# EAGLE design radio103 (EAGLE 9.6.2)

## Sheet 1 of 3: mixer
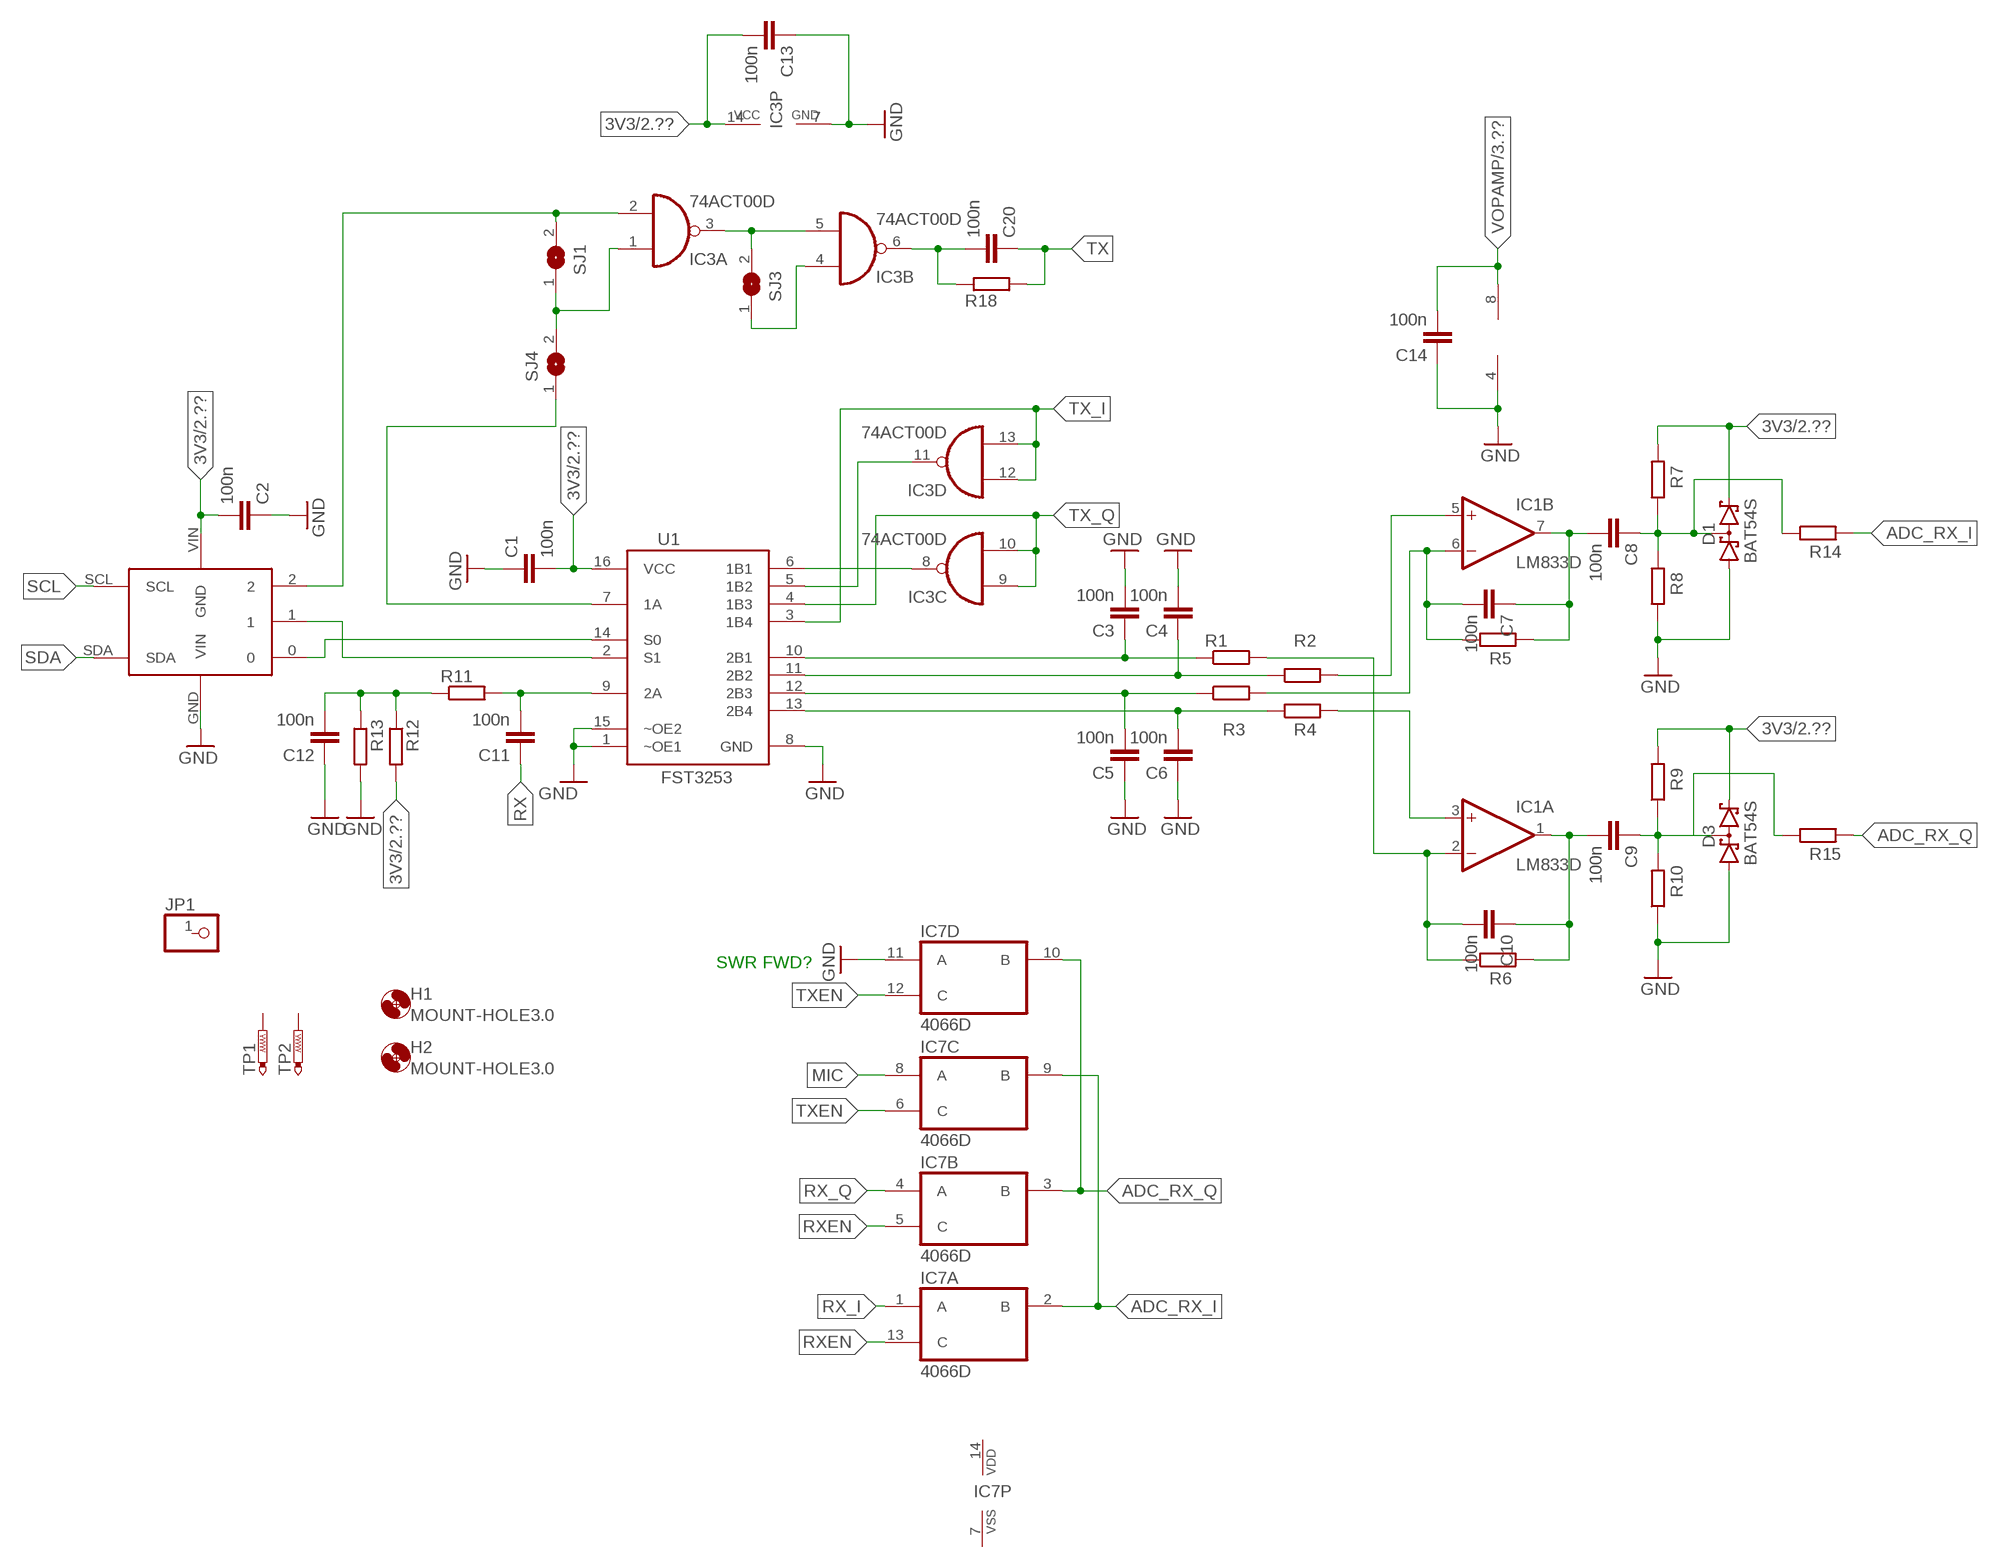
[diagram p0: schematic, sheet 1]

### Parts
C1  100n  C-EUC0805K  [C0805K]
C2  100n  C-EUC0805K  [C0805K]
C3  100n  C-EUC0805K  [C0805K]
C4  100n  C-EUC0805K  [C0805K]
C5  100n  C-EUC0805K  [C0805K]
C6  100n  C-EUC0805K  [C0805K]
C7  100n  C-EUC0805K  [C0805K]
C8  100n  C-EUC0805K  [C0805K]
C9  100n  C-EUC0805K  [C0805K]
C10  100n  C-EUC0805K  [C0805K]
C11  100n  C-EUC0805K  [C0805K]
C12  100n  C-EUC0805K  [C0805K]
C13  100n  C-EUC0805K  [C0805K]
C14  100n  C-EUC0805K  [C0805K]
C20  100n  C-EUC0805K  [C0805K]
D1  BAT54S  [SOT23]
D3  BAT54S  [SOT23]
H1  MOUNT-HOLE3.0  [3,0]
H2  MOUNT-HOLE3.0  [3,0]
IC1  LM833D  [SO08]
IC3  74ACT00D  [SO14]
IC7  4066D  [SO14]
JP1  PINHD-1X1  [1X01]
R1  R-EU_R0805  [R0805]
R2  R-EU_R0805  [R0805]
R3  R-EU_R0805  [R0805]
R4  R-EU_R0805  [R0805]
R5  R-EU_R0805  [R0805]
R6  R-EU_R0805  [R0805]
R7  R-EU_R0805  [R0805]
R8  R-EU_R0805  [R0805]
R9  R-EU_R0805  [R0805]
R10  R-EU_R0805  [R0805]
R11  R-EU_R0805  [R0805]
R12  R-EU_R0805  [R0805]
R13  R-EU_R0805  [R0805]
R14  R-EU_R0805  [R0805]
R15  R-EU_R0805  [R0805]
R18  R-EU_R0805  [R0805]
SJ1  SJ  [SJ]
SJ3  SJ  [SJ]
SJ4  SJ  [SJ]
TP1  PTR1B2,54  [B2,54]
TP2  PTR1B1,27  [B1,27]
U1  FST3253  [TSSOP16L]
U$2  CJMCU-5351  [CJMCU-5351]

### Nets
3V3: C1.2 C2.2 C13.2 D1.2(C2) D3.2(C2) IC3.14(P:VCC) R7.2 R9.2 R12.2 U1.16(VCC) U$2.VIN(GND) ; also sheet 2
ADC_I1: C8.1 D1.3(C1A2) R7.1 R8.2 R14.1
ADC_Q1: C9.1 D3.3(C1A2) R9.1 R10.2 R15.1
ADC_RX_I: IC7.2(A:B) IC7.9(C:B) R14.2
ADC_RX_Q: IC7.3(B:B) IC7.10(D:B) R15.2
GND: C1.1 C2.1 C3.2 C4.2 C5.1 C6.1 C12.1 C13.1 C14.1 D1.1(A1) D3.1(A1) IC1.4(P:V-) IC3.7(P:GND) IC7.11(D:A) R8.1 R10.1 R13.2 U1.1(~OE1) U1.8(GND) U1.15(~OE2) U$2.GND(VIN) ; also sheet 2,3
MIC: IC7.8(C:A)
N$1: C3.1 R1.1 U1.10(2B1)
N$2: C4.1 R2.1 U1.11(2B2)
N$3: C5.2 R3.1 U1.12(2B3)
N$4: C6.2 R4.1 U1.13(2B4)
N$5: C10.2 IC1.2(A:-IN) R1.2 R6.1
N$6: IC1.5(B:+IN) R2.2
N$7: C7.2 IC1.6(B:-IN) R3.2 R5.1
N$8: IC1.3(A:+IN) R4.2
N$9: C9.2 C10.1 IC1.1(A:OUT) R6.2
N$10: C7.1 C8.2 IC1.7(B:OUT) R5.2
N$12: C11.2 R11.2 U1.9(2A)
N$13: U1.2(S1) U$2.1
N$14: C12.2 R11.1 R12.1 R13.1
N$15: U1.14(S0) U$2.0
N$17: IC3.8(C:O) U1.6(1B1)
N$18: IC3.11(D:O) U1.5(1B2)
N$26: IC3.2(A:I1) SJ1.2 U$2.2
N$27: IC3.1(A:I0) SJ1.1 SJ4.2
N$28: IC3.3(A:O) IC3.5(B:I1) SJ3.2
N$29: IC3.4(B:I0) SJ3.1
N$30: C20.2 IC3.6(B:O) R18.1
N$31: SJ4.1 U1.7(1A)
RX: C11.1
RX_I: IC7.1(A:A)
RX_Q: IC7.4(B:A)
RXEN: IC7.5(B:C) IC7.13(A:C)
SCL: U$2.SCL
SDA: U$2.SDA
TX: C20.1 R18.2
TX_I: IC3.12(D:I0) IC3.13(D:I1) U1.3(1B4)
TX_Q: IC3.9(C:I0) IC3.10(C:I1) U1.4(1B3)
TXEN: IC7.6(C:C) IC7.12(D:C)
VOPAMP: C14.2 IC1.8(P:V+) ; also sheet 3
Unconnected: JP1.1 TP1.TP TP2.TP

### Notes on the sheet
- SWR FWD?

## Sheet 2 of 3: power
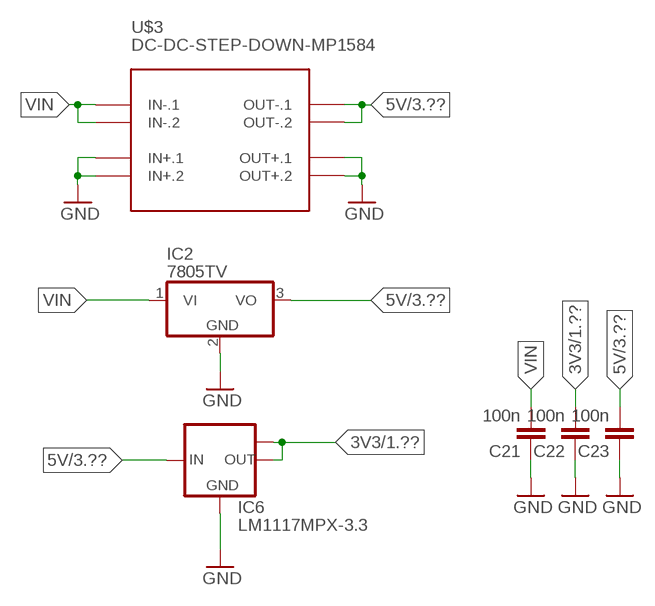
[diagram p1: schematic, sheet 2]

### Parts
C21  100n  C-EUC0805K  [C0805K]
C22  100n  C-EUC0805K  [C0805K]
C23  100n  C-EUC0805K  [C0805K]
IC2  7805TV  [TO220V]
IC6  LM1117MPX-3.3  [SOT223]
U$3  DC-DC-STEP-DOWN-MP1584  [DC-DC-STEP-DOWN-MP1584]

### Nets
3V3: C22.2 IC6.2(OUT) IC6.TAB(OUT1) ; also sheet 1
5V: C23.2 IC2.3(VO) IC6.3(IN) U$3.OUT-.1 U$3.OUT-.2 ; also sheet 3
GND: C21.1 C22.1 C23.1 IC2.2(GND) IC6.1(GND) U$3.IN+.1 U$3.IN+.2 U$3.OUT+.1 U$3.OUT+.2 ; also sheet 1,3
VIN: C21.2 IC2.1(VI) U$3.IN-.1 U$3.IN-.2

## Sheet 3 of 3: audio
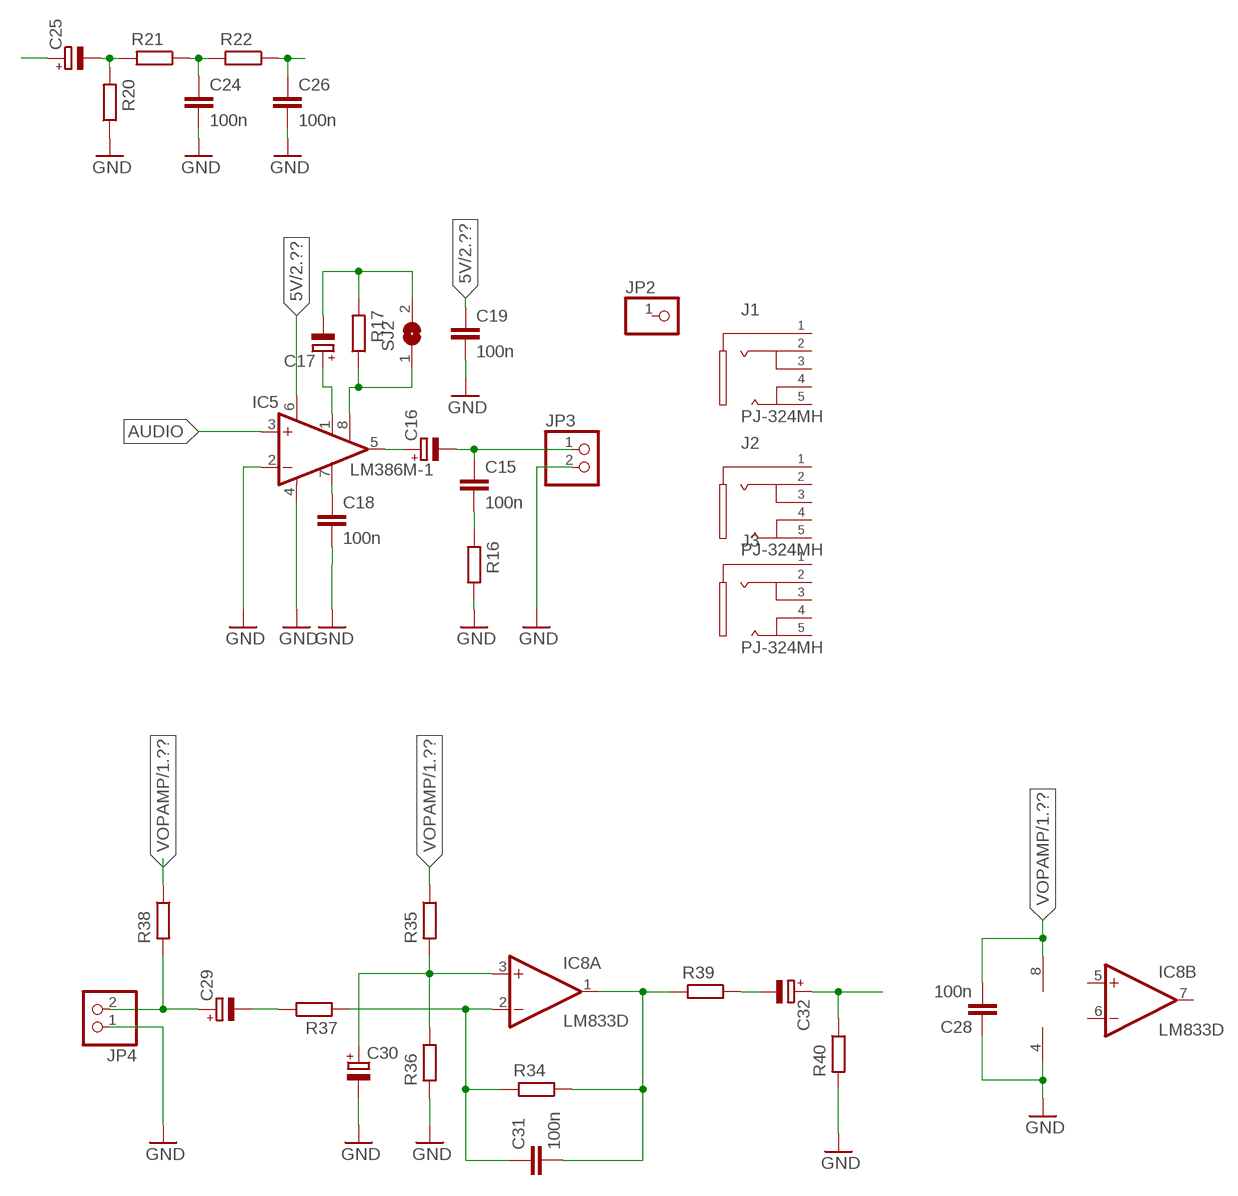
[diagram p2: schematic, sheet 3]

### Parts
C15  100n  C-EUC0805K  [C0805K]
C16  CPOL-EUE2,5-6E  [E2,5-6E]
C17  CPOL-EUE2,5-6E  [E2,5-6E]
C18  100n  C-EUC0805K  [C0805K]
C19  100n  C-EUC0805K  [C0805K]
C24  100n  C-EUC0805K  [C0805K]
C25  CPOL-EUE2,5-6E  [E2,5-6E]
C26  100n  C-EUC0805K  [C0805K]
C28  100n  C-EUC0805K  [C0805K]
C29  CPOL-EUE2,5-6E  [E2,5-6E]
C30  CPOL-EUE2,5-6E  [E2,5-6E]
C31  100n  C-EUC0805K  [C0805K]
C32  CPOL-EUE2,5-6E  [E2,5-6E]
IC5  LM386M-1  [SO08]
IC8  LM833D  [SO08]
J1  PJ-324MH  [PJ-324MH]
J2  PJ-324MH  [PJ-324MH]
J3  PJ-324MH  [PJ-324MH]
JP2  PINHD-1X1  [1X01]
JP3  PINHD-1X2  [1X02]
JP4  PINHD-1X2  [1X02]
R16  R-EU_R0805  [R0805]
R17  R-EU_R0805  [R0805]
R20  R-EU_R0805  [R0805]
R21  R-EU_R0805  [R0805]
R22  R-EU_R0805  [R0805]
R34  R-EU_R0805  [R0805]
R35  R-EU_R0805  [R0805]
R36  R-EU_R0805  [R0805]
R37  R-EU_R0805  [R0805]
R38  R-EU_R0805  [R0805]
R39  R-EU_R0805  [R0805]
R40  R-EU_R0805  [R0805]
SJ2  SJ  [SJ]

### Nets
5V: C19.1 IC5.6(VS) ; also sheet 2
AUDIO: IC5.3(+IN)
GND: C18.2 C19.2 C24.2 C26.2 C28.1 C30.- IC5.2(-IN) IC5.4(GND) IC8.4(P:V-) JP3.2 JP4.1 R16.1 R20.1 R36.2 R40.2 ; also sheet 1,2
N$19: C17.+ IC5.1(GAIN)
N$20: IC5.8(GAIN) R17.1 SJ2.1
N$21: C17.- R17.2 SJ2.2
N$22: C18.1 IC5.7(BYPASS)
N$23: C16.+ IC5.5(OUT)
N$24: C15.1 C16.- JP3.1
N$25: C15.2 R16.2
N$32: C25.- R20.2 R21.2
N$33: C24.1 R21.1 R22.2
N$34: C26.1 R22.1
N$35: C25.+
N$48: C30.+ IC8.3(A:+IN) R35.2 R36.1
N$49: C31.1 IC8.2(A:-IN) R34.2 R37.2
N$50: C31.2 IC8.1(A:OUT) R34.1 R39.2
N$51: C29.- R37.1
N$52: C29.+ JP4.2 R38.2
N$53: C32.- R39.1
N$54: C32.+ R40.1
VOPAMP: C28.2 IC8.8(P:V+) R35.1 R38.1 ; also sheet 1
Unconnected: IC8.5(B:+IN) IC8.6(B:-IN) IC8.7(B:OUT) J1.1 J1.2 J1.3 J1.4 J1.5 J2.1 J2.2 J2.3 J2.4 J2.5 J3.1 J3.2 J3.3 J3.4 J3.5 JP2.1

## Power pins joined to a net without a drawn wire
VDD: IC7.14(P:VDD)
VSS: IC7.7(P:VSS)

## Library data of the parts
C1-C15 C18-C24 C26 C28 C31 = rcl:C-EU: CAPACITOR, European symbol; SPICEPREFIX: C
C16 C17 C25 C29 C30 C32 = rcl:CPOL-EU: POLARIZED CAPACITOR, European symbol; SPICEPREFIX: C
D1 D3 = diode:BAT54S: Schottky Diodes Pin connection corrected 2011-05-04 Source: Fairchild .. BAT54.pdf
H1 H2 = holes:MOUNT-HOLE: MOUNTING HOLE with drill center marker
IC1 IC8 = linear:LM833: OP AMP
IC2 = linear:78*: Positive VOLTAGE REGULATOR Source: http://cache.national.com/ds/LM/LM78L05.pdf http://www.fairchildsemi.com/ds/LM/LM7805.pdf
IC3 = 74xx-eu:74*00: Quad 2-input NAND gate
IC5 = linear:LM386?-*: Low Voltage Audio Power Amplifier Source: http://cache.national.com/ds/LM/LM386.pdf
IC6 = lm1117:LM1117MPX-*
IC7 = 40xx:4066: Quad bilateral ANALOG SWITCH
J1-J3 = ub0baa:PJ-324M
JP1 JP2 = pinhead:PINHD-1X1: PIN HEADER
JP3 JP4 = pinhead:PINHD-1X2: PIN HEADER
R1-R18 R20-R22 R34-R40 = rcl:R-EU_: RESISTOR, European symbol; SPICEPREFIX: R
SJ1-SJ4 = jumper:SJ: SMD solder JUMPER
TP1 TP2 = testpad:PTR1: TEST PIN
U1 = ub0baa:FST3253
U$2 = ub0baa:CJMCU-5351
U$3 = diy-modules:DC-DC-STEP-DOWN-MP1584: DC/DC Step-Down Regulator based on MP1584 chip MP1584 datasheet available here: http://www.haoyuelectronics.com/Attachment/MP1584/MP1584.pdf Click here to find device on ebay.com <http://www.ebay.com/sch/mp1584+module>

## Board
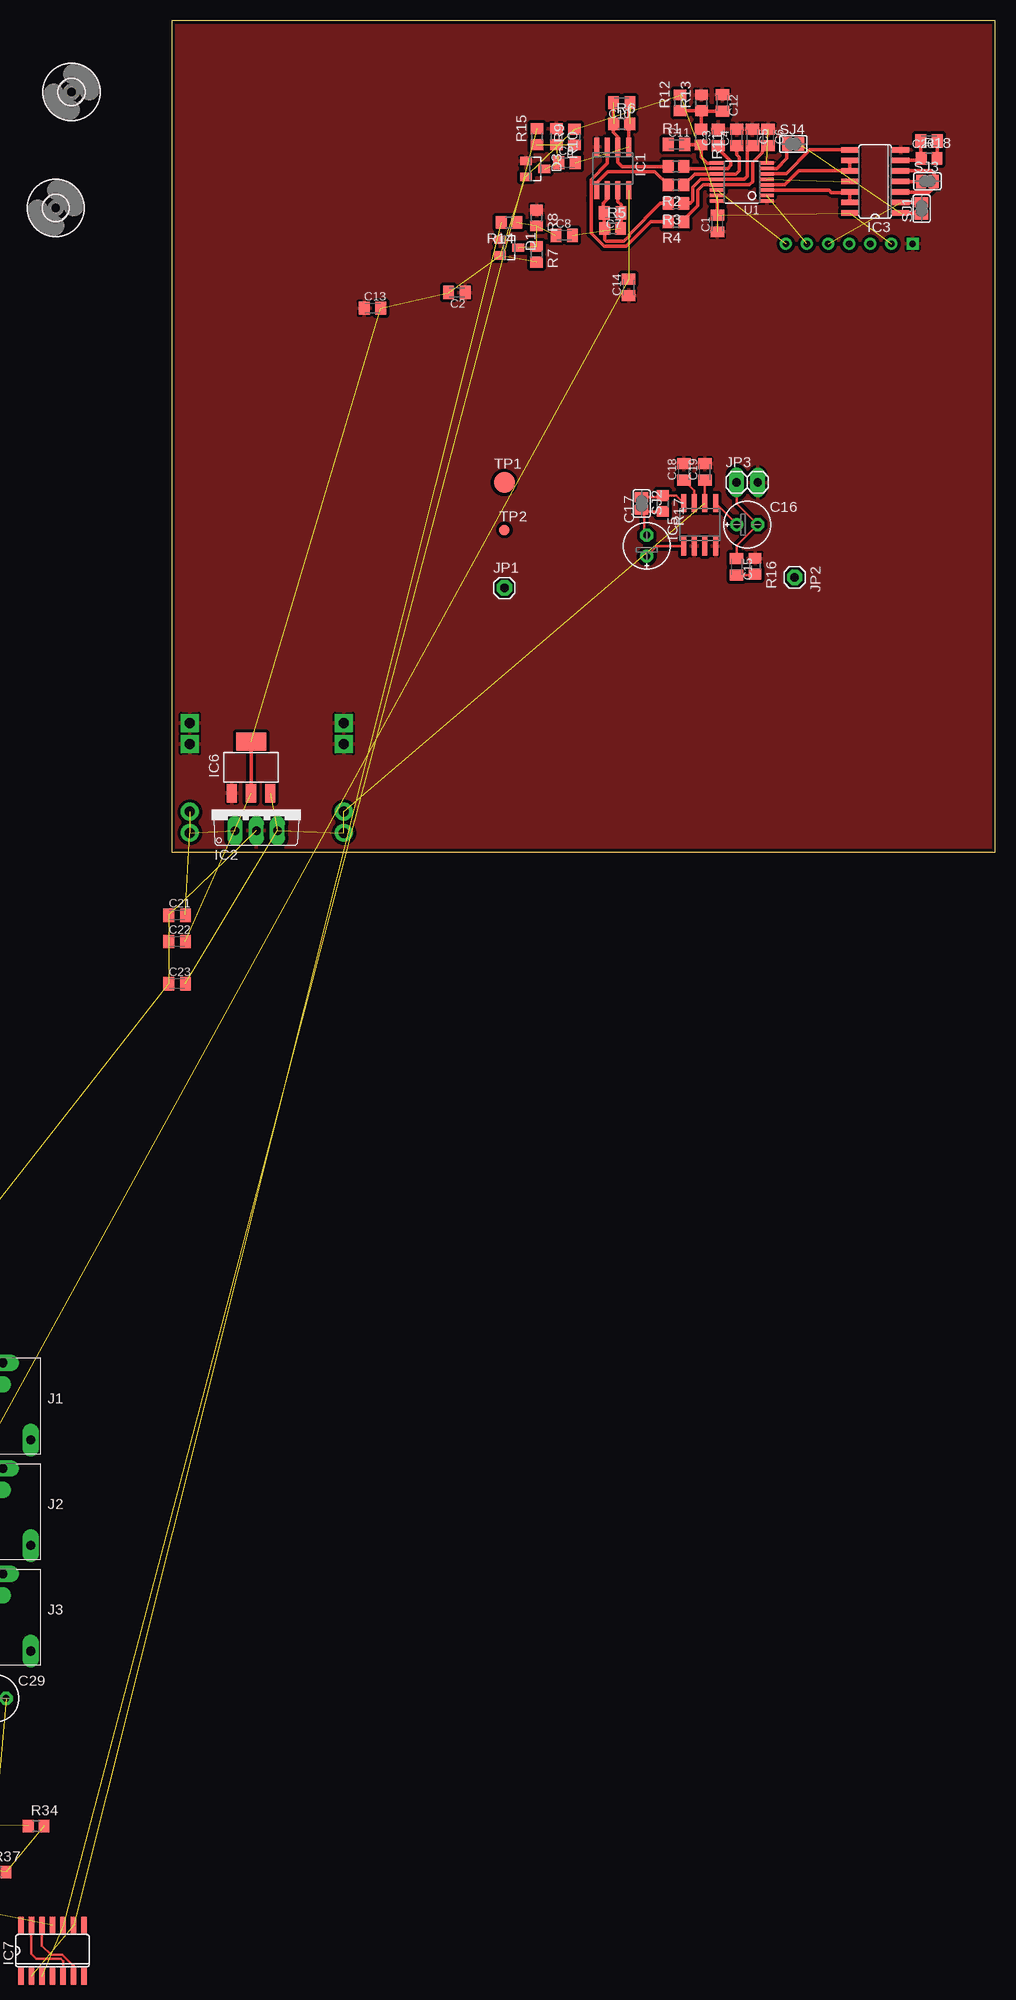
[diagram p3: board, top side]
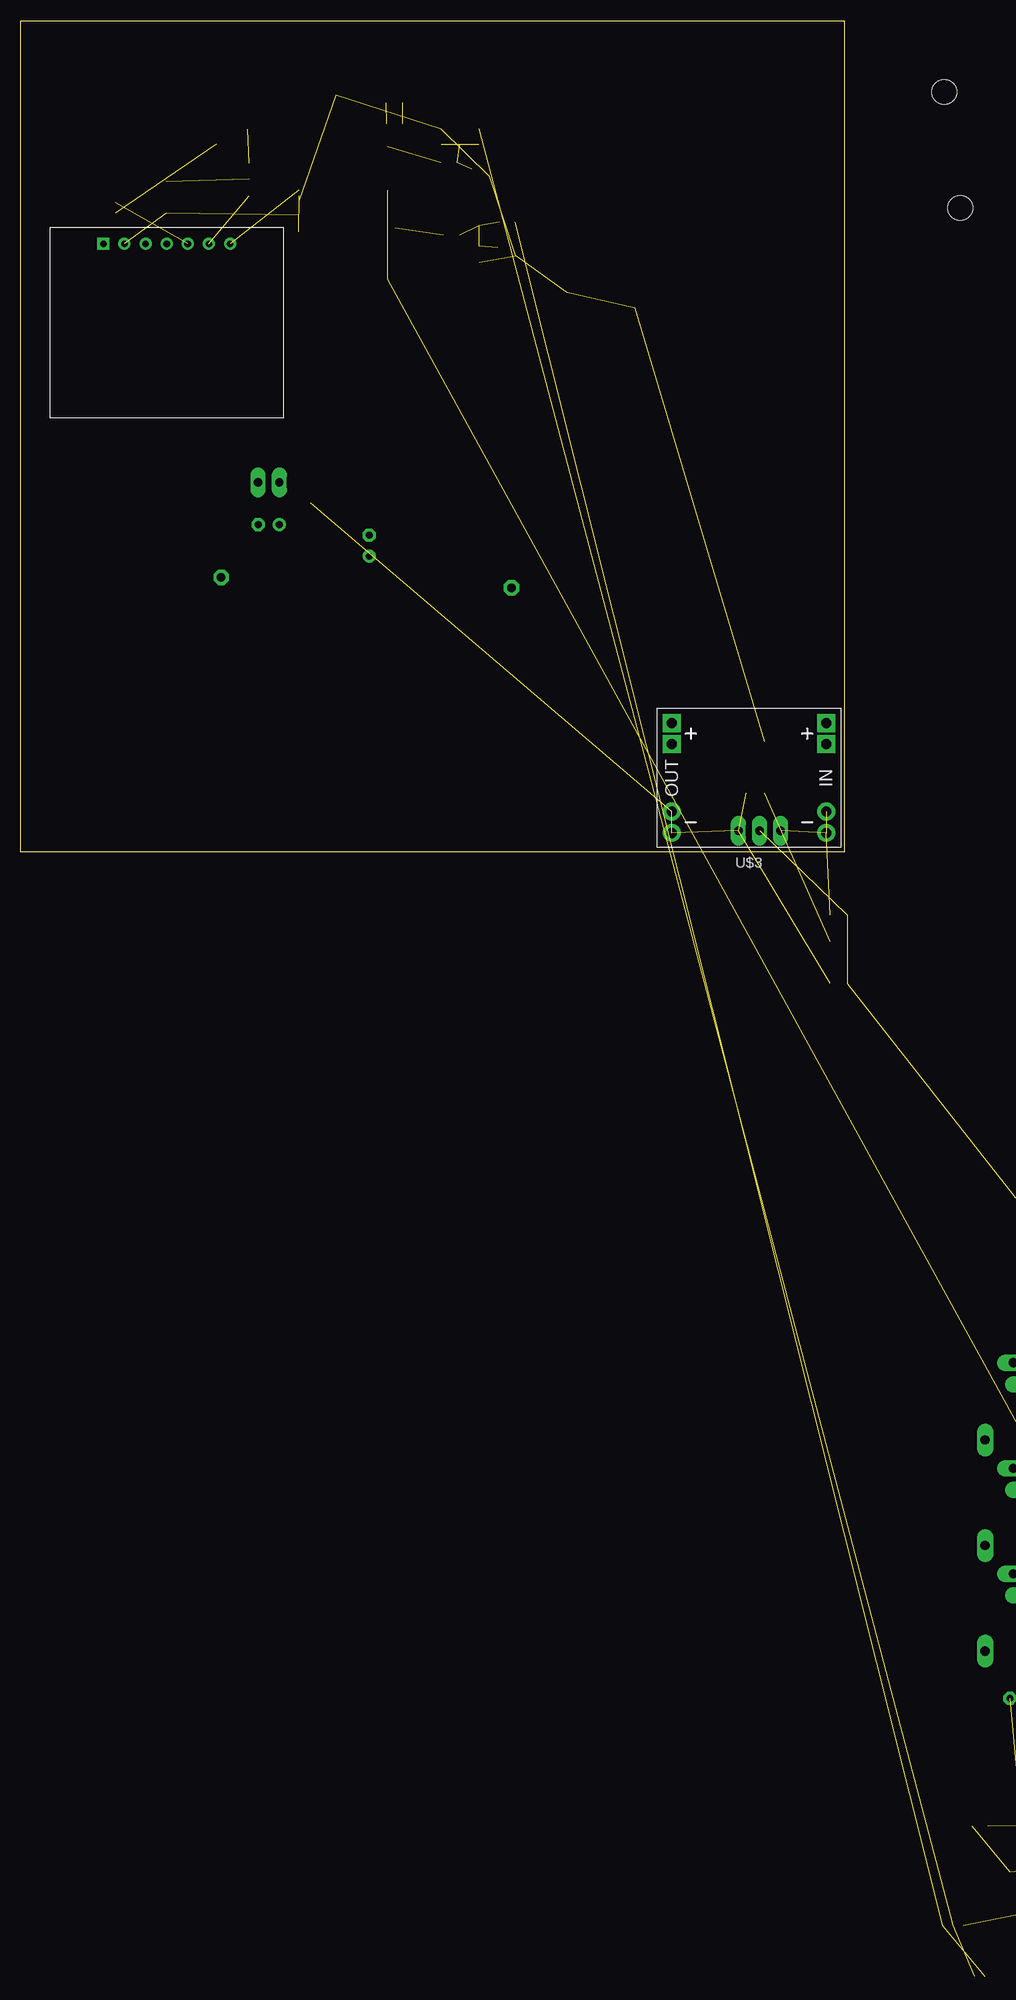
[diagram p4: board, bottom side, seen from below]

Size 99.04 x 100 mm. Coordinates in mm from the lower left corner, seen from the top.
Outline: 0,0 99.04,0 99.04,100 0,100 0,0
Copper layers (1*16): Top 0.035mm / dielectric 1.6mm / Bottom 0.035mm
Design rules "lut-rules": minimum track width 0.3mm, minimum drill 0.3mm, track to track 0.2mm, track to pad 0.2mm, pad to pad 0.2mm, via to via 0.2mm, smd to smd 5mil, copper to edge 0.2mm, drill to drill 6mil, minimum pad ring 10mil, minimum via ring 3mil, stop-mask expansion 4mil, vias tented up to drill 0mil, thermal gap 10mil

### Footprints (pad centres in the part's own frame; a part is rotated, then mirrored left to right if it is on the bottom)
C0805K = smd 1.3 x 1.6: 1 -1,0; 2 1,0
E2,5-6E = drill 0.813 pad 1.575: + -1.27,0 | drill 0.813 pad 1.575 octagon: - 1.27,0
SOT23 = smd 1 x 1.4: 1 -0.95,-1.1; 2 0.95,-1.1; 3 0,1.1
3,0 = hole 3: 0,0
SO08 = smd 0.6 x 2.2: 1 -1.905,-2.6; 2 -0.635,-2.6; 3 0.635,-2.6; 4 1.905,-2.6; 5 1.905,2.6; 6 0.635,2.6; 7 -0.635,2.6; 8 -1.905,2.6
TO220V = drill 1.016 long: 1 -2.54,-2.54; 2 0,-2.54; 3 2.54,-2.54
SO14 = smd 0.66 x 2.032: 1 -3.81,-3.073; 2 -2.54,-3.073; 3 -1.27,-3.073; 4 0,-3.073; 5 1.27,-3.073; 6 2.54,-3.073; 7 3.81,-3.073; 8 3.81,3.073; 9 2.54,3.073; 10 1.27,3.073; 11 0,3.073; 12 -1.27,3.073; 13 -2.54,3.073; 14 -3.81,3.073
SOT223 = smd 1.219 x 2.235: 1 -2.311,-3.099; 2 0,-3.099; 3 2.311,-3.099 | smd 3.6 x 2.2: TAB 0,3.099
PJ-324MH = drill 1.1 long: 1 -5.4,0; 2 2.5,5.2; 3 1.5,2.6; 4 5.9,-4.1; 5 -1.2,-4.6
1X01 = drill 1.016 octagon: 1 0,0
1X02 = drill 1.016 long: 1 -1.27,0; 2 1.27,0
R0805 = smd 1.3 x 1.5: 1 -0.95,0; 2 0.95,0
SJ = smd 1.168 x 1.6: 1 -0.762,0; 2 0.762,0
B2,54 = smd 2.54 x 2.54: TP 0,0
B1,27 = smd 1.27 x 1.27: TP 0,0
TSSOP16L = smd 0.42 x 1.78: 1 -2.275,-2.97; 2 -1.625,-2.97; 3 -0.975,-2.97; 4 -0.325,-2.97; 5 0.325,-2.97; 6 0.975,-2.97; 7 1.625,-2.97; 8 2.275,-2.97; 9 2.275,2.97; 10 1.625,2.97; 11 0.975,2.97; 12 0.325,2.97; 13 -0.325,2.97; 14 -0.975,2.97; 15 -1.625,2.97; 16 -2.275,2.97
CJMCU-5351 = drill 0.8: 0 -7.62,0; 1 -5.08,0; 2 -2.54,0; SCL 0,0; SDA 2.54,0; VIN 5.08,0 | drill 0.8 square: GND 7.62,0
DC-DC-STEP-DOWN-MP1584 = drill 1.2 pad 2 square: IN+.1 -9.271,-4.064; IN+.2 -9.271,-6.604; OUT+.1 9.271,-4.064; OUT+.2 9.271,-6.604 | drill 1.2 pad 2: IN-.1 -9.271,6.604; IN-.2 -9.271,4.064; OUT-.1 9.271,6.604; OUT-.2 9.271,4.064

### Placement (x,y rotation side)
C1  65.63,75.6 90 top
C2  34.29,67.31 180 top
C3  65.73,85.95 90 top
C4  67.96,85.96 90 top
C5  69.85,85.96 270 top
C6  71.73,85.96 270 top
C7  53.03,76.89 180 top
C8  47.2,74.17 0 top
C9  47.53,82.92 0 top
C10  54.12,90.13 180 top
C11  60.71,85.12 0 top
C12  66.23,90.12 270 top
C13  24.13,65.41 0 top
C14  54.95,67.92 90 top
C15  67.94,34.29 270 top
C16  69.22,39.37 0 top
C17  57.13,36.83 90 top
C18  61.59,45.72 90 top
C19  64.14,45.72 90 top
C20  91.09,85.55 180 top
C21  0.64,-7.62 0 top  (outside the outline)
C22  0.64,-10.79 0 top  (outside the outline)
C23  0.64,-15.88 0 top  (outside the outline)
C24  -31.75,-48.9 0 top  (outside the outline)
C25  -30.48,-43.18 0 top  (outside the outline)
C26  -27.3,-48.9 0 top  (outside the outline)
C28  -46.69,-114.28 270 top  (outside the outline)
C29  -21.22,-101.87 0 top  (outside the outline)
C30  -37.55,-128.31 270 top  (outside the outline)
C31  -43.42,-120.48 180 top  (outside the outline)
C32  -43.42,-127.33 0 top  (outside the outline)
D1  40.58,72.7 270 top
D3  43.7,82.17 270 top
H1  -12.06,91.44 0 top  (outside the outline)
H2  -13.97,77.47 0 top  (outside the outline)
IC1  53.03,82.22 180 top
IC2  10.16,5.08 0 top
IC3  84.6,80.66 90 top
IC5  63.5,39.37 0 top
IC6  9.53,10.16 0 top
IC7  -14.37,-132.23 0 top  (outside the outline)
IC8  -42.45,-114.28 0 top  (outside the outline)
J1  -22.86,-66.67 0 top  (outside the outline)
J2  -22.86,-79.38 0 top  (outside the outline)
J3  -22.86,-92.08 0 top  (outside the outline)
JP1  40.01,31.75 0 top
JP2  74.93,33.02 0 top
JP3  69.22,44.45 0 top
JP4  -32,-111.99 0 top  (outside the outline)
R1  60.65,82.46 180 top
R2  60.65,80.24 180 top
R3  60.65,78.03 180 top
R4  60.65,75.82 180 top
R5  53.02,75.02 0 top
R6  54.12,87.59 0 top
R7  43.89,71.91 270 top
R8  43.88,76.27 270 top
R9  48.46,86.01 90 top
R10  46.25,86.05 270 top
R11  63.66,86.01 270 top
R12  61.15,90.12 90 top
R13  63.69,90.12 90 top
R14  40.56,75.74 180 top
R15  43.92,86.05 90 top
R16  70.17,34.35 270 top
R17  59.05,41.91 270 top
R18  91.1,83.41 0 top
R20  -31.11,-54.61 0 top  (outside the outline)
R21  -25.4,-54.61 0 top  (outside the outline)
R22  -31.11,-59.05 0 top  (outside the outline)
R34  -16.32,-117.21 0 top  (outside the outline)
R35  -46.69,-118.19 270 top  (outside the outline)
R36  -26.12,-122.76 0 top  (outside the outline)
R37  -20.9,-122.76 0 top  (outside the outline)
R38  -35.59,-122.76 0 top  (outside the outline)
R39  -43.42,-122.76 180 top  (outside the outline)
R40  -26.12,-127.01 0 top  (outside the outline)
SJ1  90.2,77.4 90 top
SJ2  56.52,41.91 270 top
SJ3  90.89,80.68 0 top
SJ4  74.75,85.17 0 top
TP1  40.01,44.45 0 top
TP2  40.01,38.73 0 top
U1  68.58,80.59 90 top
U$2  81.49,73.16 180 bottom
U$3  11.43,8.89 180 bottom

### Tracks (layer width: path | path; a pad name or v marks a point on that pad's centre or on a via)
3V3  (11 unrouted)
  Top 0.4: IC6.2 IC6.TAB
  Top 0.406: C1.2 65.61,76.62 U1.16
5V  (5 unrouted)
  Top 0.3: IC5.6 C19.1
ADC_I1  (4 unrouted)
ADC_Q1  (4 unrouted)
ADC_RX_I  (2 unrouted)
ADC_RX_Q  (2 unrouted)
GND  (15 unrouted)
  pour Top (isolate 0.4): 0,99.95 0,0 99.06,0 99.06,99.95
N$1
  Top 0.406: 61.65,82.51 R1.1 61.84,82.21 U1.10 66.87,82.21 67.26,82.61 67.26,83.1 65.73,84.62 C3.1
N$2
  Top 0.406: C4.1 67.96,83.86 68.24,83.58 68.24,81.95 67.85,81.56 U1.11 62.92,81.56 R2.1
N$3
  Top 0.406: C5.2 69.22,84.33 69.22,81.3 68.83,80.91 U1.12 63.61,80.91 62.69,79.99 62.69,78.36 62.36,78.03 R3.1
N$4
  Top 0.406: 61.6,75.75 R4.1 | 61.6,76.16 R4.1 | C6.2 71.05,84.28 71.05,84.14 69.87,82.96 69.87,80.64 69.49,80.26 U1.13 63.94,80.26 63.29,79.62 63.29,77.76 61.6,76.06 R4.1
N$5  (1 unrouted)
  Top 0.406: R1.2 54.19,82.46 53.67,82.98 IC1.2 53.67,86.08 53.12,86.62 C10.2
N$6
  Top 0.406: R2.2 58.09,81.85 52.47,81.85 51.13,80.51 IC1.5
N$7
  Top 0.406: IC1.6 52.4,78.52 51.91,78.03 51.91,77.01 C7.2 52.03,75.06 R5.1 52.07,73.63 52.24,73.46 54.39,73.46 55.02,74.1 55.02,74.29 58.77,78.03 R3.2
N$8
  Top 0.406: IC1.3 52.4,82.86 50.42,80.89 50.42,78.69 50.42,78.36 50.42,74.42 51.99,72.86 54.64,72.86 57.6,75.82 R4.2
N$9  (2 unrouted)
  Top 0.406: IC1.1 54.94,89.94 C10.1
N$10  (1 unrouted)
  Top 0.406: IC1.7 53.67,78.24 54.03,77.87 C7.1 54.03,75.08 R5.2
N$12
  Top 0.4: C11.2 63.6,85.12 R11.2 63.66,83.59 64.39,82.86 U1.9
  Top 0.406: C11.2 61.77,85.06 | U1.9 64.72,82.86
N$13  (1 unrouted)
N$14
  Top 0.4: R12.1 R13.1 | R13.1 63.74,89.12 C12.2 | R11.1 63.66,89.14 R13.1
N$15  (1 unrouted)
N$17
  Top 0.406: U1.6 71.58,81.6 73.9,81.6 76.77,84.47 IC3.8
N$18  (1 unrouted)
N$19
  Top 0.3: C17.+ 58.34,36.77 IC5.1
N$20
  Top 0.3: SJ2.1 58.87,42.67 R17.1 60.7,42.86 IC5.8
N$21
  Top 0.3: SJ2.2 56.7,40.96 56.81,40.96 | 56.81,40.96 R17.2 | C17.- 56.81,38.42 56.81,40.96
N$22
  Top 0.3: IC5.7 62.87,43.45 C18.1
N$23
  Top 0.3: IC5.5 67.94,39.43 C16.+
N$24
  Top 0.3: C15.1 67.94,36.83 C16.- 67.94,41.91 JP3.1
N$25
  Top 0.3: R16.2 70.05,33.29 C15.2
N$26  (1 unrouted)
  Top 0.4: IC3.2 90.16,78.12 SJ1.2
N$27  (1 unrouted)
  Top 0.4: IC3.1 89.98,76.85 SJ1.1
N$28
  Top 0.406: IC3.5 91.44,81.93 91.75,81.62 91.75,80.78 | 91.75,80.78 SJ3.2 | IC3.3 91.14,79.39 91.75,79.99 91.75,80.78
N$29
  Top 0.406: IC3.4 90.11,80.66 SJ3.1
N$30
  Top 0.406: IC3.6 89.93,83.2 R18.1 90.09,83.47 C20.2
N$31
  Top 0.406: SJ4.1 73.99,83.46 72.75,82.21 U1.7
N$32  (2 unrouted)
N$33  (2 unrouted)
N$34  (1 unrouted)
N$48  (3 unrouted)
N$49  (3 unrouted)
N$50  (3 unrouted)
N$51  (1 unrouted)
N$52  (2 unrouted)
N$53  (1 unrouted)
N$54  (1 unrouted)
RXEN
  Top 0.3: IC7.5 -13.1,-133.5 -13.39,-133.21 -16.32,-133.21 -16.91,-132.63 IC7.13
TX
  Top 0.406: C20.1 92.09,83.46 R18.2
TX_I
  Top 0.406: IC3.13 IC3.12 81.48,79.34 79.34,79.34 79.07,79.61 U1.3
TX_Q
  Top 0.406: IC3.9 IC3.10 75.4,81.93 73.73,80.26 U1.4
TXEN
  Top 0.3: IC7.12 -15.64,-131.62 -14.54,-132.71 -13.18,-132.71 -11.91,-133.99 -11.87,-133.99 -11.83,-134.03 IC7.6
VIN  (3 unrouted)
VOPAMP  (5 unrouted)